# EAGLE design tester (EAGLE 5.11)
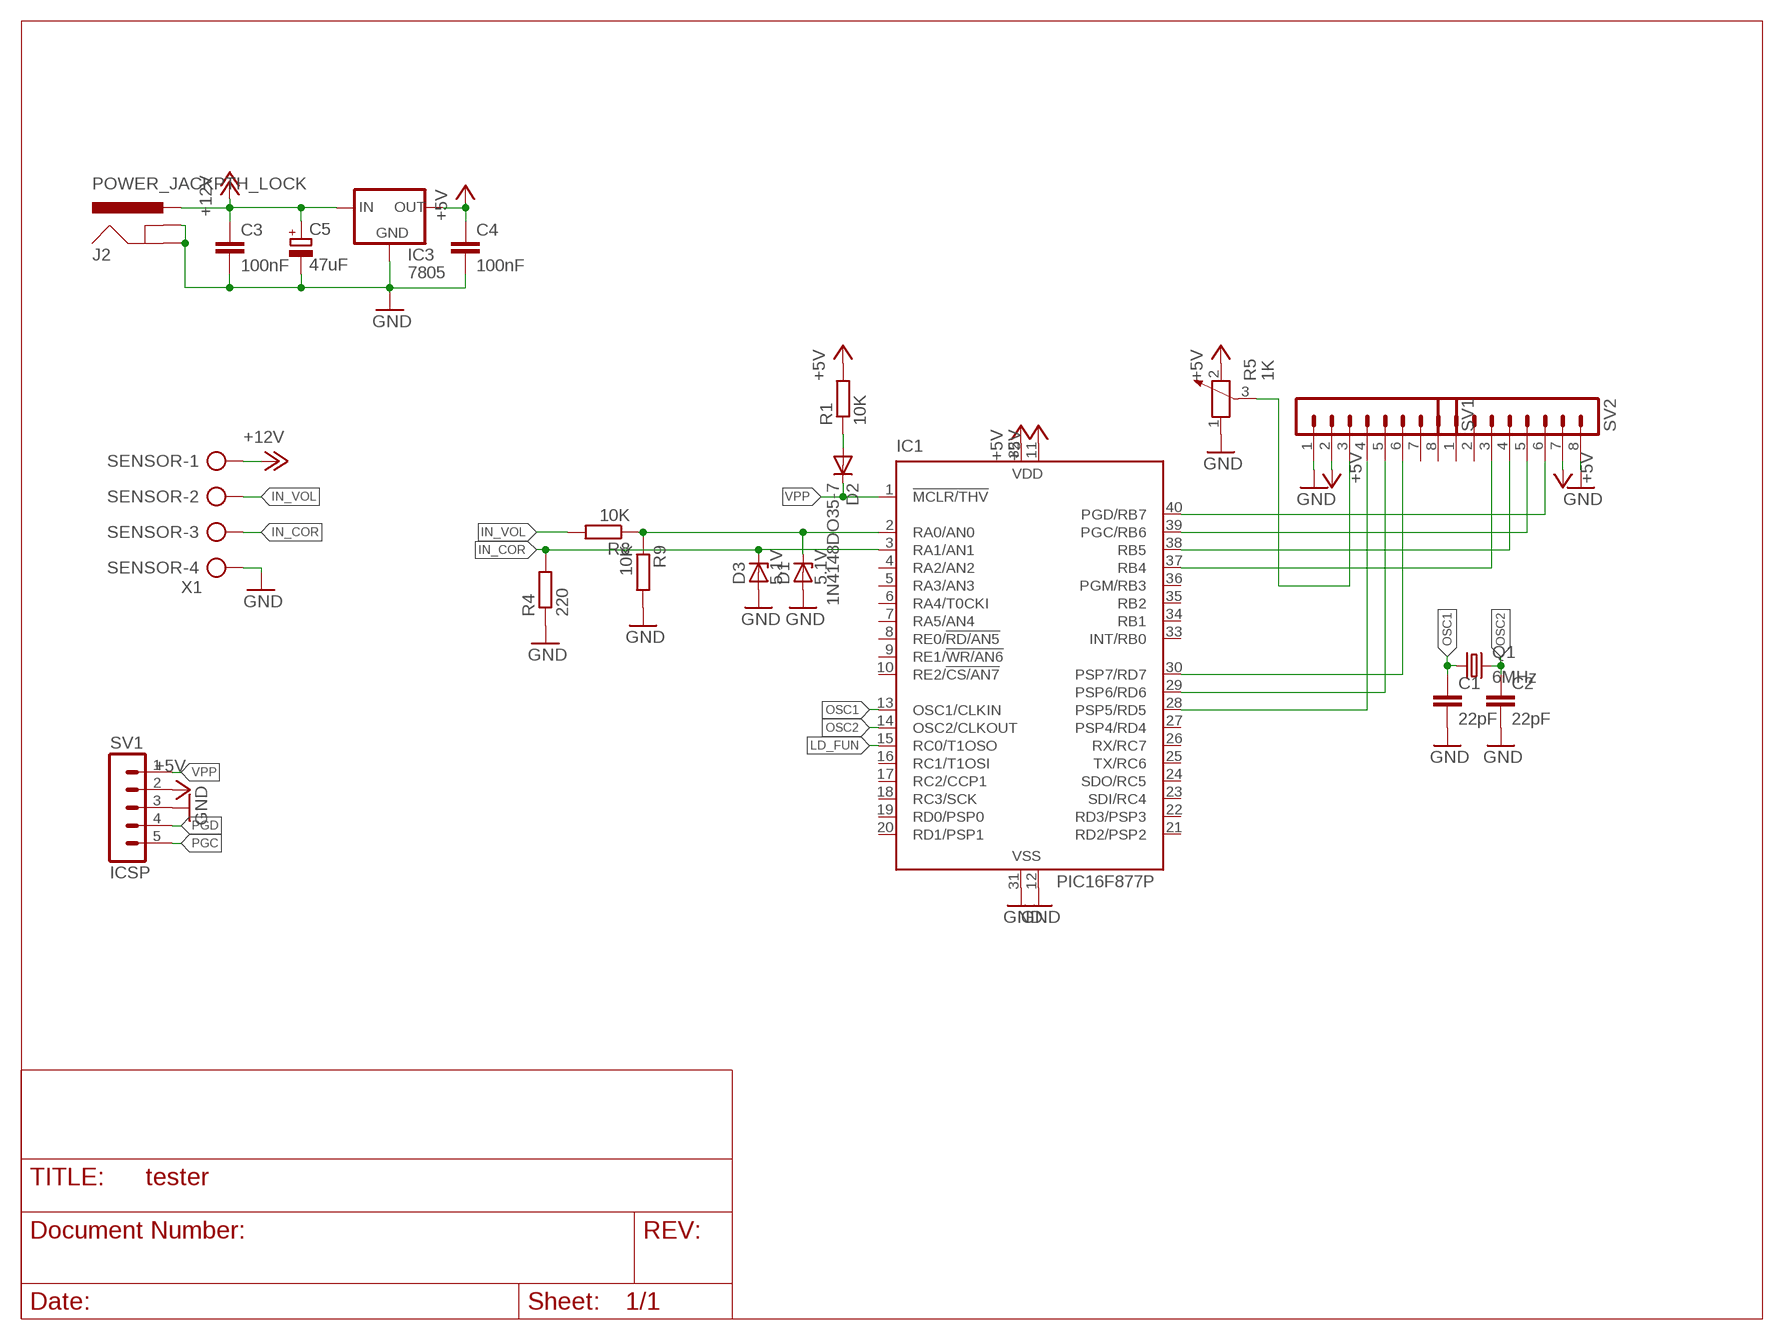
[diagram p0: schematic, sheet 1]

## Parts
C1  22pF  C-EU025-025X050  [C025-025X050]
C2  22pF  C-EU025-025X050  [C025-025X050]
C3  100nF  C-EU050-024X044  [C050-024X044]
C4  100nF  C-EU050-024X044  [C050-024X044]
C5  47uF  CPOL-EUE2.5-6  [E2,5-6]
D1  5.1V  ZENER-DIODEDO35Z10  [DO35Z10]
D2  1N4148DO35-7  [DO35-7]
D3  5.1V  ZENER-DIODEDO35Z10  [DO35Z10]
IC1  PIC16F877P  [DIL40]
IC3  7805  78XXL  [78XXL]
ICSP  SV1  MA05-1  [MA05-1]
J2  POWER_JACKPTH_LOCK  [POWER_JACK_PTH_LOCK]
Q1  6MHz  CRYSTALHC49S  [HC49/S]
R1  10K  R-EU_0207/7  [0207/7]
R4  220  R-EU_0309/10  [0309/10]
R5  1K  POTENTIOMETER_PT_SPIN  [PT-SPIN]
R8  10K  R-EU_0207/7  [0207/7]
R9  10K  R-EU_0207/7  [0207/7]
SENSOR  X1  AK500/4  [AK500/4]
SV1  MA08-1  [MA08-1]
SV2  MA08-1  [MA08-1]

## Nets
+5V: C4.1 IC1.11(VDD) IC1.32(VDD) IC3.OUT ICSP.2 R1.2 R5.2 SV1.2 SV2.7
+12V: C3.1 C5.+ IC3.IN J2.PWR SENSOR.1
GND: C1.2 C2.2 C3.2 C4.2 C5.- D1.A D3.A IC1.12(VSS) IC1.31(VSS) IC3.GND ICSP.3 J2.GND J2.GNDBREAK R4.1 R5.1 R9.2 SENSOR.4 SV1.1 SV2.8
IN_COR: D3.C IC1.3(RA1/AN1) R4.2 SENSOR.3
IN_VOL: R8.2 SENSOR.2
LD_FUN: IC1.15(RC0/T1OSO)
N$1: R5.3 SV1.3
N$2: D2.A R1.1
N$3: IC1.38(RB5) SV2.4
N$4: IC1.37(RB4) SV2.3
N$5: IC1.30(PSP7/RD7) SV1.6
N$6: IC1.29(PSP6/RD6) SV1.5
N$7: IC1.28(PSP5/RD5) SV1.4
N$10: D1.C IC1.2(RA0/AN0) R8.1 R9.1
OSC1: C1.1 IC1.13(OSC1/CLKIN) Q1.1
OSC2: C2.1 IC1.14(OSC2/CLKOUT) Q1.2
PGC: IC1.39(PGC/RB6) ICSP.5 SV2.5
PGD: IC1.40(PGD/RB7) ICSP.4 SV2.6
VPP: D2.C IC1.1(!MCLR/THV) ICSP.1
Unconnected: IC1.4(RA2/AN2) IC1.5(RA3/AN3) IC1.6(RA4/T0CKI) IC1.7(RA5/AN4) IC1.8(RE0/!RD/AN5) IC1.9(RE1/!WR/AN6) IC1.10(RE2/!CS/AN7) IC1.16(RC1/T1OSI) IC1.17(RC2/CCP1) IC1.18(RC3/SCK) IC1.19(RD0/PSP0) IC1.20(RD1/PSP1) IC1.21(RD2/PSP2) IC1.22(RD3/PSP3) IC1.23(SDI/RC4) IC1.24(SDO/RC5) IC1.25(TX/RC6) IC1.26(RX/RC7) IC1.27(PSP4/RD4) IC1.33(INT/RB0) IC1.34(RB1) IC1.35(RB2) IC1.36(PGM/RB3) SV1.7 SV1.8 SV2.1 SV2.2

## Library data of the parts
C1-C4 = rcl:C-EU: CAPACITOR, European symbol
C5 = rcl:CPOL-EU: POLARIZED CAPACITOR, European symbol
D1 D3 = diode:ZENER-DIODE: Z-Diode
D2 = diode:1N4148: DIODE high speed (Philips)
IC1 = microchip:PIC16F87*: MICROCONTROLLER; MF: MICROCHIP; MPN: PIC16F877-04/P; OC_FARNELL: 9761349; OC_NEWARK: 61K3463
IC3 = v-reg:78XXL: VOLTAGE REGULATOR
ICSP = con-lstb:MA05-1: PIN HEADER; OC_FARNELL: unknown; OC_NEWARK: unknown
J2 = SparkFun:POWER_JACK: Power Jack This is the standard 5.5mm barrel jack for power. The PTH is the most common, proven, reliable, footprint. All others are experimental. The Slot footprint only works if the mill layer is transmitted to the PCB fab house so be warned. Spark Fun Electronics SKU : PRT-00119. Mating wall wart : TOL-00298 (and others)
Q1 = crystal:CRYSTAL: CRYSTAL; OC_FARNELL: 1667008; OC_NEWARK: unknown
R1 R4 R8 R9 = rcl:R-EU_: RESISTOR, European symbol
R5 = rcl:POTENTIOMETER_: Potentiometer
SENSOR = con-ptr500:AK500/4: CONNECTOR; OC_FARNELL: unknown; OC_NEWARK: unknown
SV1 SV2 = con-lstb:MA08-1: PIN HEADER; OC_FARNELL: unknown; OC_NEWARK: unknown

## Board
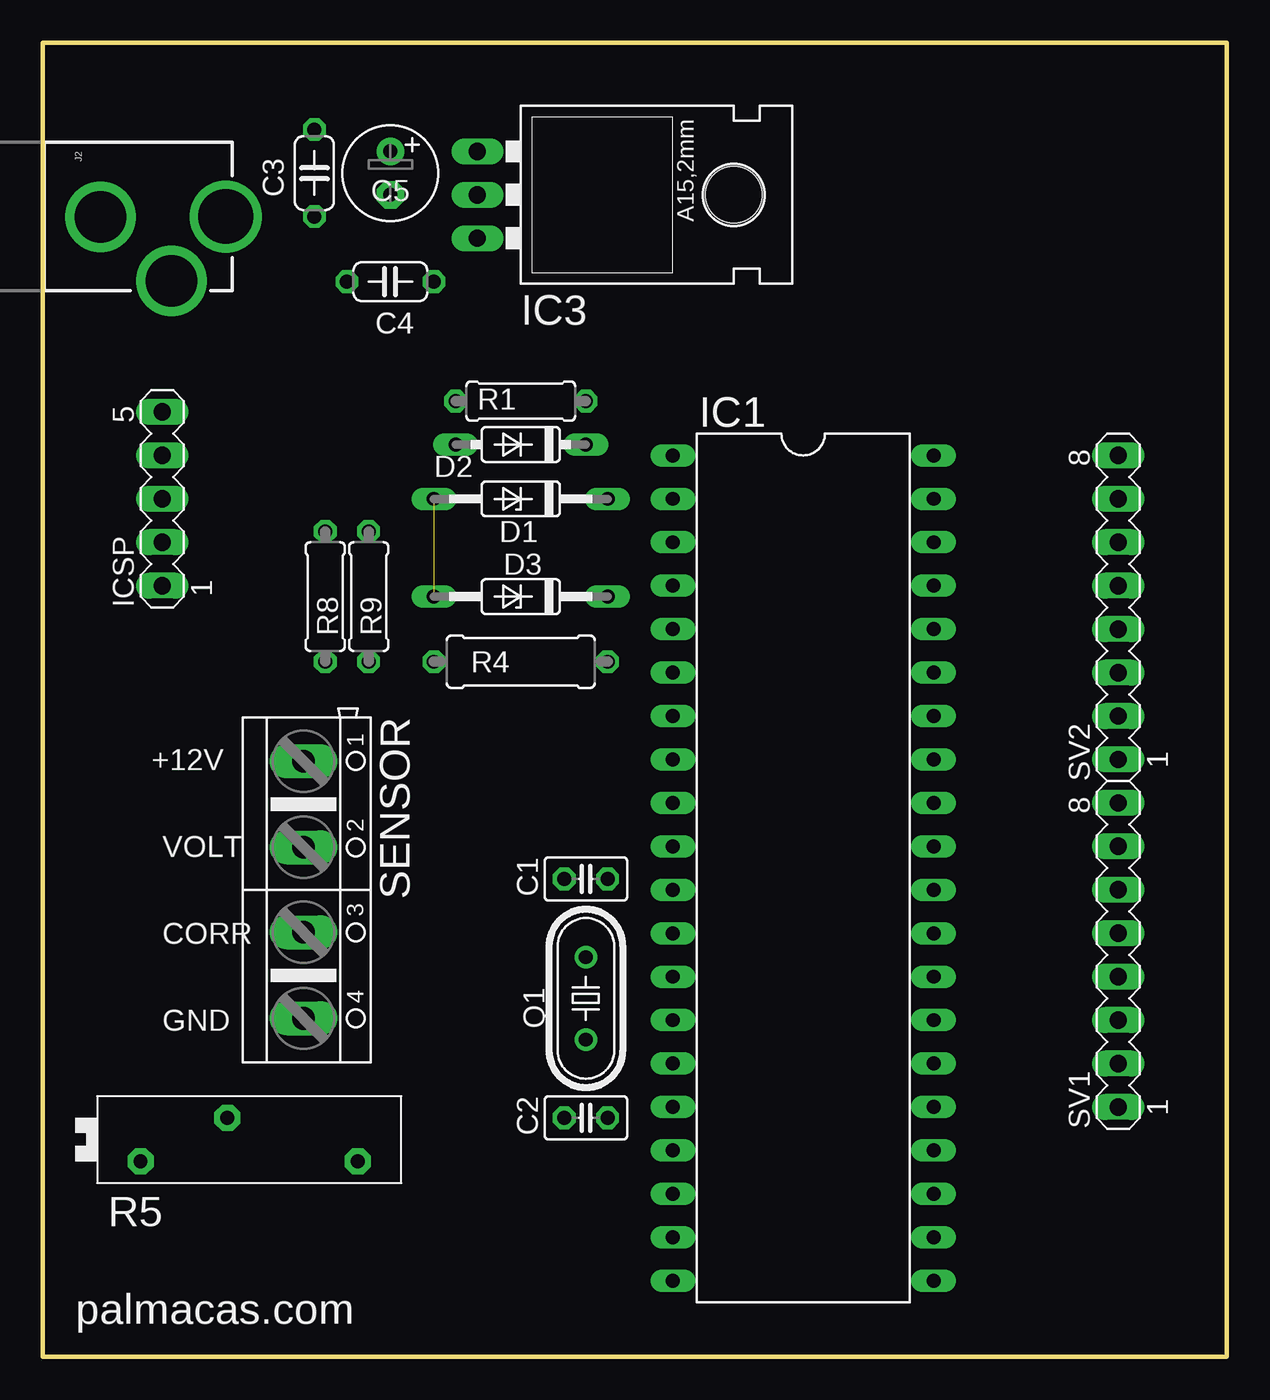
[diagram p1: board, top side]
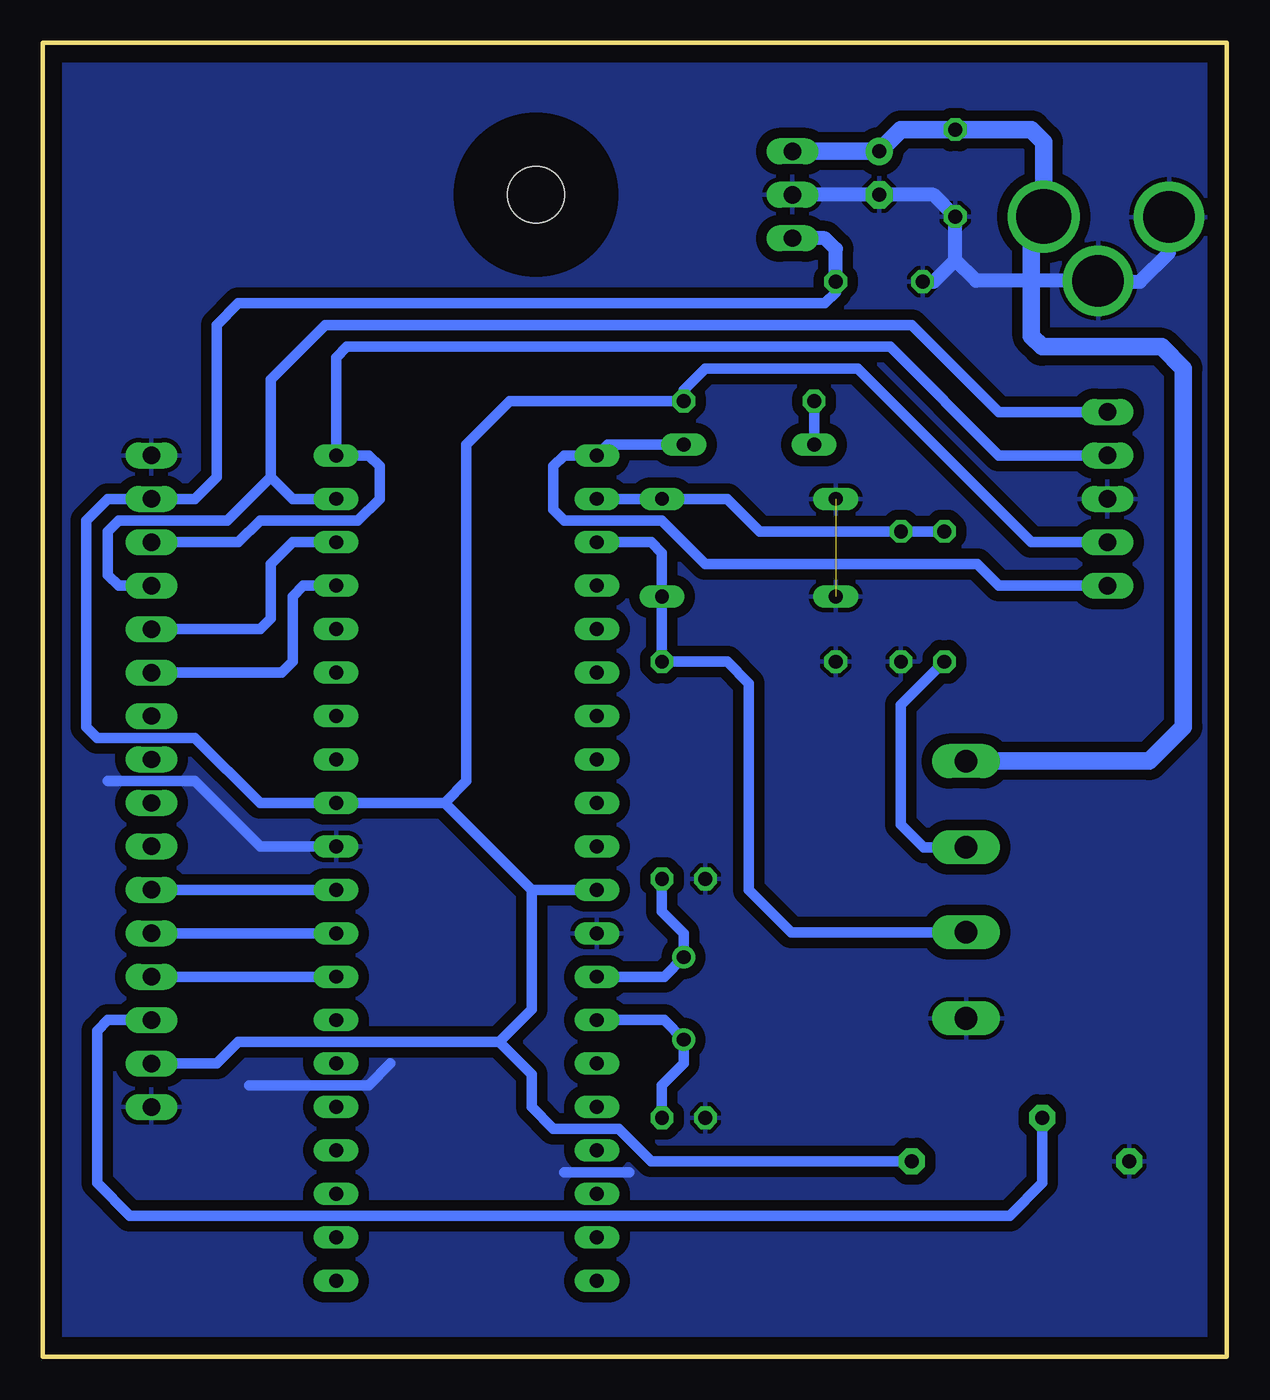
[diagram p2: board, bottom side, seen from below]

Size 69.22 x 76.83 mm. Coordinates in mm from the lower left corner, seen from the top.
Outline: 0,0 69.22,0 69.22,76.83 0,76.83 0,0
Copper layers (1*16): Top 0.035mm / dielectric 1.5mm / Bottom 0.035mm
Design rules "default": minimum track width 10mil, minimum drill 24mil, track to track 8mil, track to pad 8mil, pad to pad 8mil, via to via 8mil, smd to smd 8mil, copper to edge 40mil, drill to drill 8mil, minimum pad ring 10mil, minimum via ring 8mil, stop-mask expansion 4mil, vias tented up to drill 0mil, thermal gap 10mil

### Footprints (pad centres in the part's own frame; a part is rotated, then mirrored left to right if it is on the bottom)
C025-025X050 = drill 0.813 octagon: 1 -1.27,0; 2 1.27,0
C050-024X044 = drill 0.813 octagon: 1 -2.54,0; 2 2.54,0
E2,5-6 = drill 0.813 pad 1.6: + -1.27,0 | drill 0.813 pad 1.6 octagon: - 1.27,0
DO35Z10 = drill 0.813 long: A 5.08,0; C -5.08,0
DO35-7 = drill 0.813 long: A 3.81,0; C -3.81,0
DIL40 = drill 0.813 long: 1 -24.13,-7.62; 2 -21.59,-7.62; 3 -19.05,-7.62; 4 -16.51,-7.62; 5 -13.97,-7.62; 6 -11.43,-7.62; 7 -8.89,-7.62; 8 -6.35,-7.62; 9 -3.81,-7.62; 10 -1.27,-7.62; 11 1.27,-7.62; 12 3.81,-7.62; 13 6.35,-7.62; 14 8.89,-7.62; 15 11.43,-7.62; 16 13.97,-7.62; 17 16.51,-7.62; 18 19.05,-7.62; 19 21.59,-7.62; 20 24.13,-7.62; 21 24.13,7.62; 22 21.59,7.62; 23 19.05,7.62; 24 16.51,7.62; 25 13.97,7.62; 26 11.43,7.62; 27 8.89,7.62; 28 6.35,7.62; 29 3.81,7.62; 30 1.27,7.62; 31 -1.27,7.62; 32 -3.81,7.62; 33 -6.35,7.62; 34 -8.89,7.62; 35 -11.43,7.62; 36 -13.97,7.62; 37 -16.51,7.62; 38 -19.05,7.62; 39 -21.59,7.62; 40 -24.13,7.62
78XXL = drill 1.016 long: GND 0,-3.81; IN -2.54,-3.81; OUT 2.54,-3.81 | hole 3.302: 0,11.176
MA05-1 = drill 1.016 long: 1 -5.08,0; 2 -2.54,0; 3 0,0; 4 2.54,0; 5 5.08,0
POWER_JACK_PTH_LOCK = drill 2.997 pad 4.115: GND 0.025,6.557; GNDBREAK 3.762,10.7 | drill 3.2 pad 4.115: PWR 0,13.878
HC49/S = drill 0.813: 1 -2.413,0; 2 2.413,0
0207/7 = drill 0.813 octagon: 1 -3.81,0; 2 3.81,0
0309/10 = drill 0.813 octagon: 1 -5.08,0; 2 5.08,0
PT-SPIN = drill 0.813 pad 1.524 octagon: 1 -6.35,-1.27; 2 6.35,-1.27; 3 -1.27,1.27
AK500/4 = drill 1.321 long: 1 -7.518,0; 2 -2.489,0; 3 2.489,0; 4 7.518,0
MA08-1 = drill 1.016 long: 1 -8.89,0; 2 -6.35,0; 3 -3.81,0; 4 -1.27,0; 5 1.27,0; 6 3.81,0; 7 6.35,0; 8 8.89,0

### Placement (x,y rotation side)
C1  31.75,27.94 180 top
C2  31.75,13.97 180 top
C3  15.88,69.22 270 top
C4  20.32,62.87 180 top
C5  20.32,69.22 270 top
D1  27.94,50.16 180 top
D2  27.94,53.34 180 top
D3  27.94,44.45 180 top
IC1  44.45,28.57 270 top
IC3  29.21,67.94 270 top
ICSP  6.99,50.16 90 top
J2  -3.17,66.67 270 top
Q1  31.75,20.95 270 top
R1  27.94,55.88 0 top
R4  27.94,40.64 0 top
R5  12.06,12.7 0 top
R8  16.51,44.45 270 top
R9  19.05,44.45 270 top
SENSOR  15.24,27.3 270 top
SV1  62.87,23.5 90 top
SV2  62.87,43.81 90 top

### Tracks (layer width: path | path; a pad name or v marks a point on that pad's centre or on a via)
+5V
  Bottom 0.61: 40.64,27.3 IC1.11 | 40.64,27.3 45.72,32.38 | 45.72,32.38 IC1.32 56.52,32.38 60.33,36.2 66.04,36.2 66.67,36.83 66.67,48.9 65.41,50.16 SV2.7 60.33,50.16 59.05,51.44 59.05,60.33 57.78,61.59 23.5,61.59 22.86,62.23 C4.1 | ICSP.2 11.43,47.62 21.59,57.78 30.48,57.78 31.75,56.52 R1.2 41.91,55.88 44.45,53.34 44.45,33.66 45.72,32.38 | R5.2 33.66,11.43 35.56,13.34 39.37,13.34 40.64,14.61 40.64,16.51 42.55,18.41 | 42.55,18.41 57.78,18.41 59.05,17.14 SV1.2 | 40.64,27.3 40.64,20.32 42.55,18.41
  Bottom 0.813: IC3.OUT 23.5,65.41 22.86,64.77 C4.1
+12V
  Bottom 1.016: IC3.IN C5.+ 19.05,71.75 C3.1 11.43,71.75 10.7,71.03 J2.PWR 11.43,65.95 11.43,59.69 10.79,59.05 3.81,59.05 2.54,57.78 2.54,36.83 4.55,34.82 SENSOR.1
GND  (1 unrouted)
  Bottom 0.61: 48.9,17.14 50.16,15.88 57.15,15.88 | 34.92,10.79 38.73,10.79 | IC1.31 56.52,29.84 60.33,33.66 65.41,33.66
  Bottom 0.813: J2.GND 3.38,64.56 5.08,62.87 7.48,62.87 J2.GNDBREAK 14.65,62.91 15.88,64.14 | 15.88,64.14 C3.2 17.14,67.94 C5.- IC3.GND | 15.88,64.14 17.14,62.87 C4.2
  pour Bottom (isolate 0.61): 0,0 69.22,0 69.22,76.83 0,76.83
IN_COR
  Bottom 0.61: IC1.3 33.66,47.62 33.02,46.99 D3.C R4.2 29.21,40.64 27.94,39.37 27.94,27.3 25.45,24.82 SENSOR.3
IN_VOL
  Bottom 0.61: SENSOR.2 17.73,29.79 19.05,31.11 19.05,38.1 R8.2
N$1
  Bottom 0.61: R5.3 10.79,10.16 12.7,8.26 64.14,8.26 66.04,10.16 66.04,19.05 65.41,19.68 SV1.3
N$2
  Bottom 0.61: D2.A R1.1
N$3
  Bottom 0.61: IC1.38 54.61,47.62 55.88,46.35 55.88,43.18 56.52,42.55 SV2.4
N$4
  Bottom 0.61: IC1.37 53.98,45.09 54.61,44.45 54.61,40.64 55.24,40.01 SV2.3
N$5
  Bottom 0.61: IC1.30 SV1.6
N$6
  Bottom 0.61: IC1.29 SV1.5
N$7
  Bottom 0.61: IC1.28 SV1.4
N$10
  Bottom 0.61: IC1.2 D1.C 29.21,50.16 27.3,48.26 R9.1 R8.1
OSC1
  Bottom 0.61: IC1.13 32.89,22.23 Q1.1 31.75,24.77 33.02,26.04 C1.1
OSC2
  Bottom 0.61: IC1.14 32.89,19.68 Q1.2 31.75,17.14 33.02,15.88 C2.1
PGC
  Bottom 0.61: ICSP.5 13.34,55.24 18.41,60.33 52.7,60.33 55.88,57.15 55.88,51.44 | 55.88,51.44 54.61,50.16 IC1.39 | SV2.5 64.77,45.09 65.41,45.72 65.41,48.26 64.77,48.9 58.42,48.9 55.88,51.44
PGD
  Bottom 0.61: ICSP.4 13.34,52.7 19.68,59.05 51.44,59.05 52.07,58.42 IC1.40 50.16,52.7 49.53,52.07 49.53,50.16 50.8,48.9 56.52,48.9 57.78,47.62 SV2.6
VPP
  Bottom 0.61: D2.C 36.2,53.34 IC1.1 38.73,52.7 39.37,52.07 39.37,49.53 38.73,48.9 33.02,48.9 30.48,46.35 14.61,46.35 13.34,45.09 ICSP.1

### Text on the board
tPlace: +12V | VOLT | CORR | GND | palmacas.com